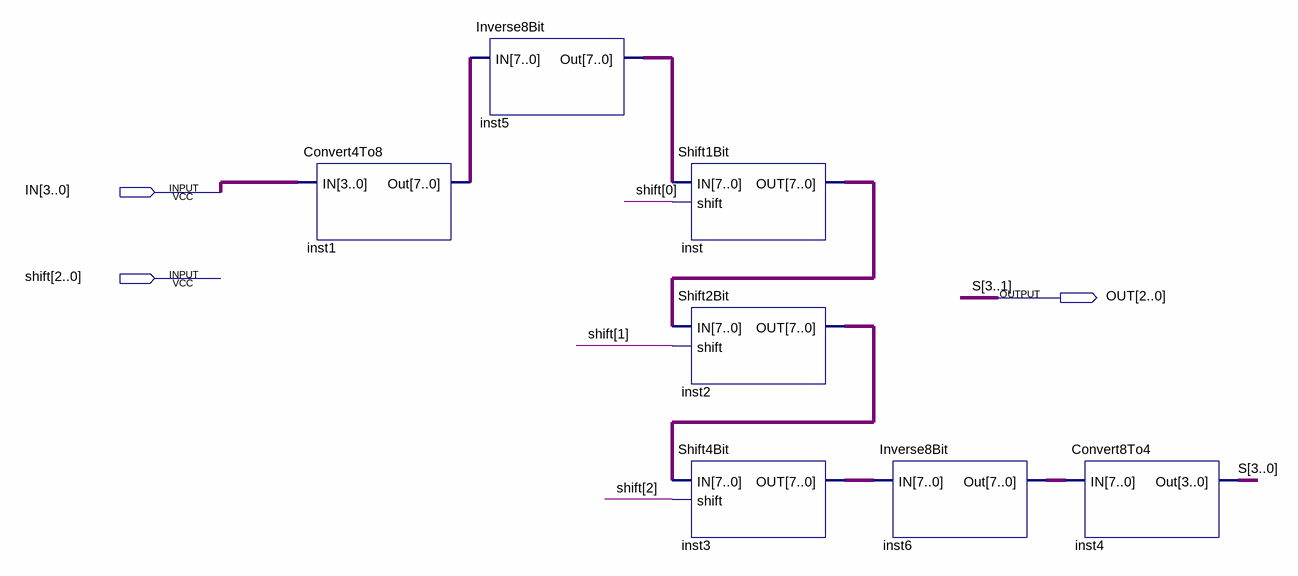
[diagram p0: schematic sheet]
// Quartus schematic Shift4BitWidth3.bdf as structural Verilog: 7 symbols, 3 pins
module Shift4BitWidth3 (
  input  [3:0] IN,
  input  [2:0] shift,
  output [2:0] OUT
);

  wire [0:0] S;
  wire [7:0] inst1_out, inst2_out, inst3_out, inst5_out, inst6_out, inst_out;

  Convert4To8 inst1 (.IN(IN), .Out(inst1_out));
  Inverse8Bit inst5 (.IN(inst1_out), .Out(inst5_out));
  Shift1Bit inst (.IN(inst5_out), .shift(shift[0]), .OUT(inst_out));
  Shift2Bit inst2 (.IN(inst_out), .shift(shift[1]), .OUT(inst2_out));
  Shift4Bit inst3 (.IN(inst2_out), .shift(shift[2]), .OUT(inst3_out));
  Inverse8Bit inst6 (.IN(inst3_out), .Out(inst6_out));
  Convert8To4 inst4 (.IN(inst6_out), .Out({OUT, S[0]}));

  // Other names for the same wires on the sheet: S[3:1] = OUT
endmodule
